# EAGLE design Main (EAGLE 7.1.0)
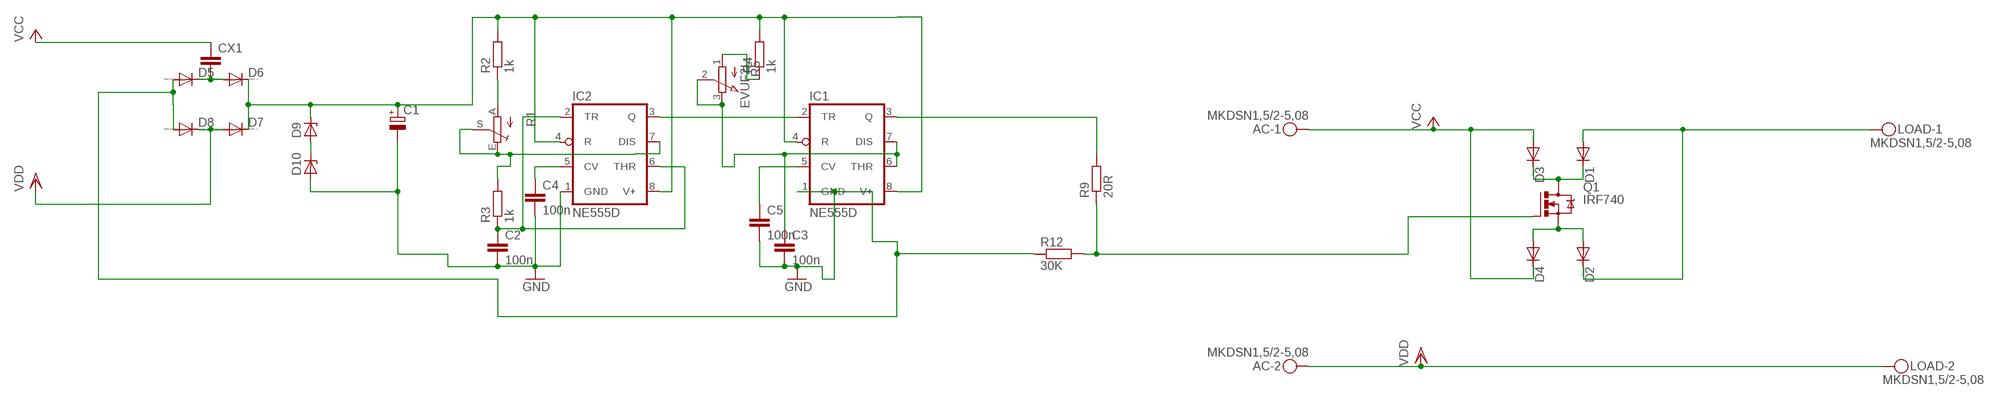
[diagram p0: schematic, sheet 1]

## Parts
AC  MKDSN1,5/2-5,08  [MKDSN1,5/2-5,08]
C1  CPOL-EUE2.5-7  [E2,5-7]
C2  100n  C-EUC0805  [C0805]
C3  100n  C-EUC0805  [C0805]
C4  100n  C-EUC0805  [C0805]
C5  100n  C-EUC0805  [C0805]
CX1  CXXC15B8  [XC15B8]
D1  DIODE-DO220S  [DO220S]
D2  DIODE-DO220S  [DO220S]
D3  DIODE-DO220S  [DO220S]
D4  DIODE-DO220S  [DO220S]
D5  DIODE-DO-214AC  [DO-214AC]
D6  DIODE-DO-214AC  [DO-214AC]
D7  DIODE-DO-214AC  [DO-214AC]
D8  DIODE-DO-214AC  [DO-214AC]
D9  ZENER-DIODESOD80C  [SOD80C]
D10  ZENER-DIODESOD80C  [SOD80C]
IC1  NE555D  [SO08]
IC2  NE555D  [SO08]
LOAD  MKDSN1,5/2-5,08  [MKDSN1,5/2-5,08]
Q1  IRF740  [TO220BV]
R1  TRIM_EU-S75H  [S75H]
R2  1k  R-EU_R1206  [R1206]
R3  1k  R-EU_R1206  [R1206]
R4  1k  R-EU_R1206  [R1206]
R5  EVUF2L  [EVUFXL]
R9  20R  R-EU_R1206  [R1206]
R12  30K  R-EU_R0805  [R0805]

## Nets
GND: C1.- C2.2 C3.2 C4.2 C5.2 D5.A D8.A D10.A IC1.1(GND) IC2.1(GND) R12.1
N$1: D2.A D4.A Q1.S
N$2: D1.C D3.C Q1.D
N$4: IC1.3(Q) R9.2
N$5: D1.A D2.C LOAD.1
N$9: CX1.2 D5.C D6.A
N$10: C1.+ D6.C D7.C D9.C IC1.4(R) IC1.8(V+) IC2.4(R) IC2.8(V+) R2.2 R4.2
N$11: D9.A D10.C
N$14: R1.A R2.1
N$15: IC2.7(DIS) R1.E R1.S R3.2
N$17: C2.1 IC2.2(TR) IC2.6(THR) R3.1
N$18: IC1.2(TR) IC2.3(Q)
N$20: C4.1 IC2.5(CV)
N$30: C5.1 IC1.5(CV)
N$31: Q1.G R9.1 R12.2
N$32: R4.1 R5.1(A)
N$33: C3.1 IC1.6(THR) IC1.7(DIS) R5.2(S) R5.3(E)
VCC: AC.1 CX1.1 D3.A D4.C
VDD: AC.2 D7.A D8.C LOAD.2

## Library data of the parts
AC LOAD = con-phoenix-508:MKDSN1,5/2-5,08: MKDSN 1,5/ 2-5,08 Printklemme Nennstrom: 13,5 A Nennspannung: 250 V Rastermaß: 5,08 mm Polzahl: 2 Anschlussart: Schraubanschluss Montage: Löten Anschlussrichtung Leiter/Platine: 0 ° Artikelnummer: 1729128 Source: http://eshop.phoenixcontact.com .. 1729128.pdf
C1 = rcl:CPOL-EU: POLARIZED CAPACITOR, European symbol
C2-C5 = rcl:C-EU: CAPACITOR, European symbol
CX1 = rcl:CX: X CAPACITOR for power line
D1-D8 = diode:DIODE-: DIODE
D9 D10 = diode:ZENER-DIODE: Z-Diode
IC1 IC2 = linear:*555: TIMER
Q1 = transistor-power:IRF740: N-CHANNEL MOS FET
R1 = pot:TRIM_EU-: POTENTIOMETER
R2-R4 R9 R12 = rcl:R-EU_: RESISTOR, European symbol
R5 = pot:EVU: 9 mm Square Rotary Potentiometers Source: Panasonic

## Board
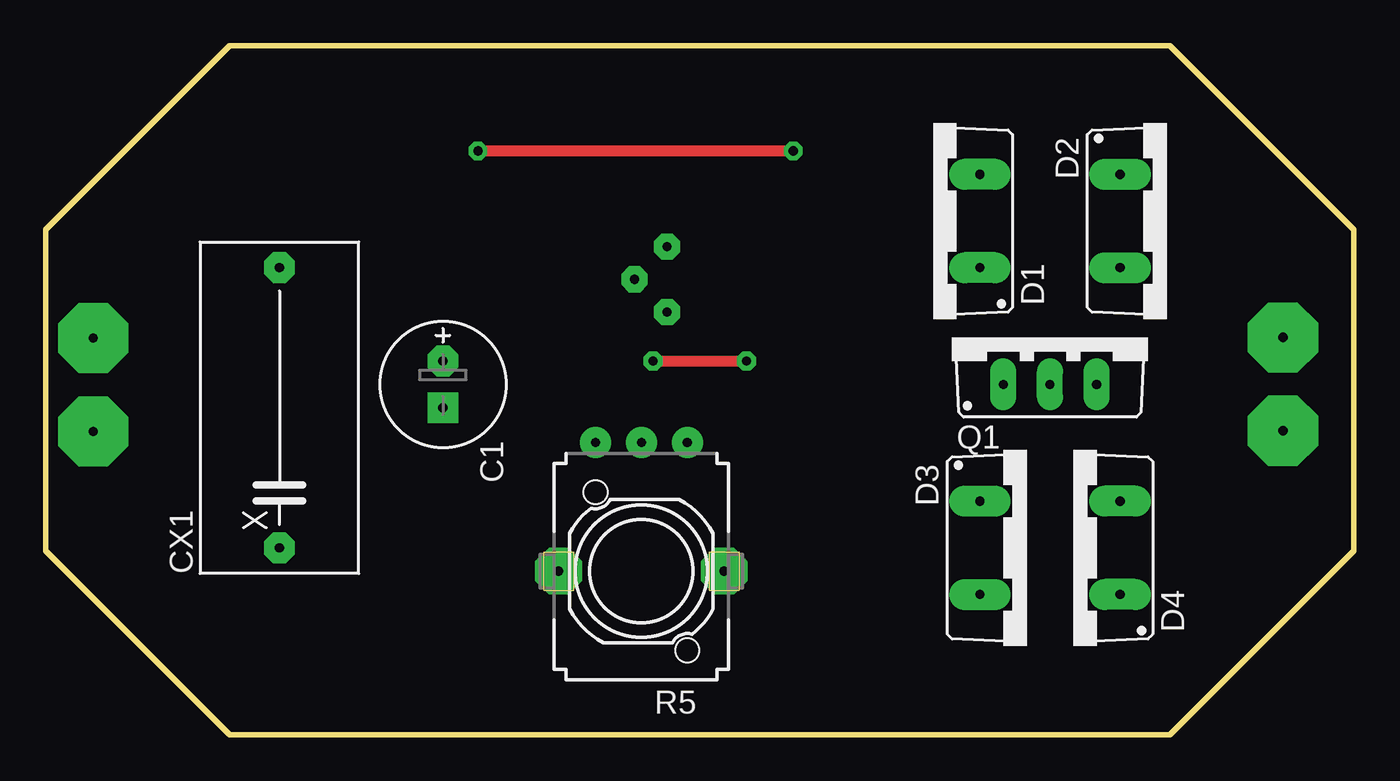
[diagram p1: board, top side]
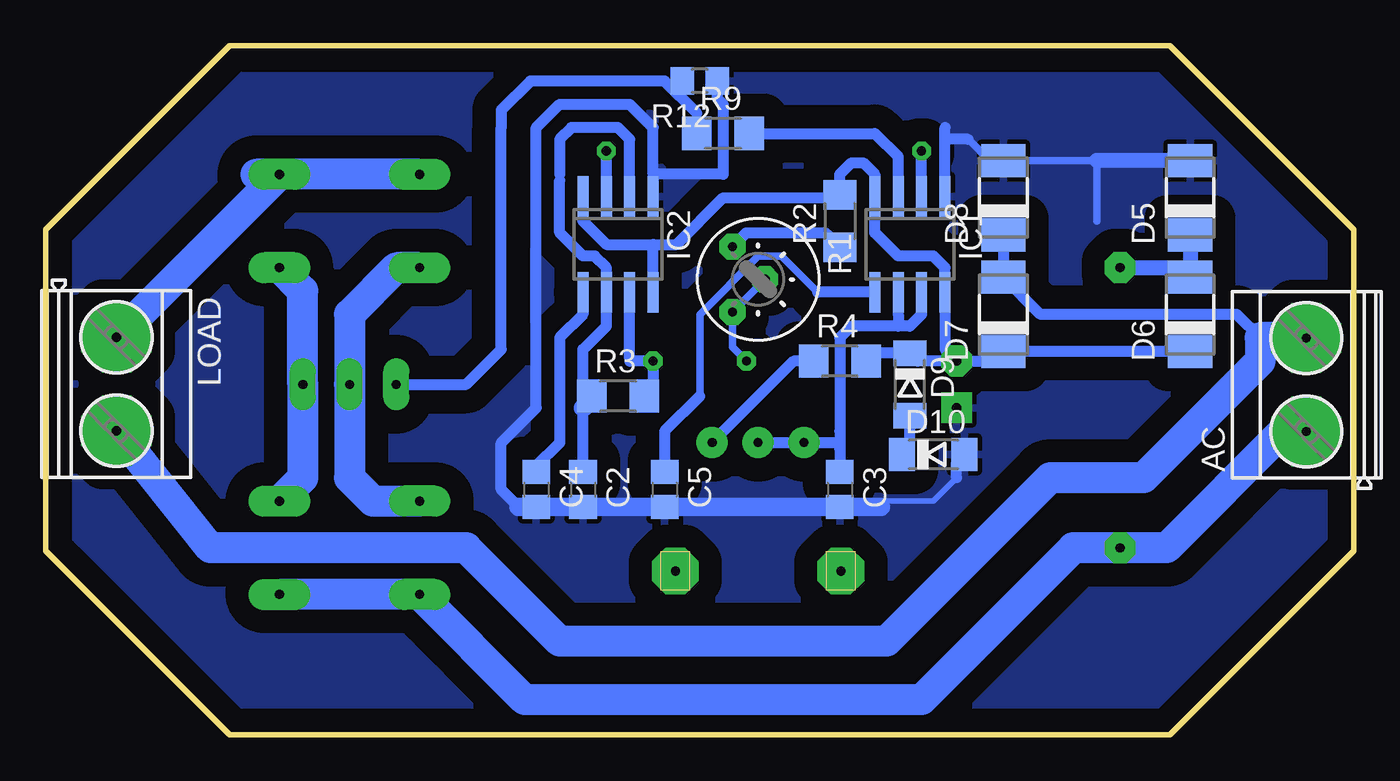
[diagram p2: board, bottom side, seen from below]

Size 71.12 x 37.47 mm. Coordinates in mm from the lower left corner, seen from the top.
Outline: 10,37.47 61.12,37.47 71.12,27.46 71.12,10 61.12,0 10,0 0,10 0,27.46 10,37.47
Copper layers (1*16): Top 0.035mm / dielectric 1.5mm / Bottom 0.035mm
Design rules "default": minimum track width 10mil, minimum drill 24mil, track to track 8mil, track to pad 8mil, pad to pad 8mil, via to via 8mil, smd to smd 8mil, copper to edge 40mil, drill to drill 8mil, minimum pad ring 10mil, minimum via ring 8mil, stop-mask expansion 4mil, vias tented up to drill 0mil, thermal gap 10mil

### Footprints (pad centres in the part's own frame; a part is rotated, then mirrored left to right if it is on the bottom)
MKDSN1,5/2-5,08 = drill 0.5 pad 3.81 octagon: 1 -2.561,0.025; 2 2.519,0.025
E2,5-7 = drill 0.5 pad 1.676 octagon: + -1.27,0 | drill 0.5 pad 1.676 square: - 1.27,0
C0805 = smd 1.3 x 1.5: 1 -0.95,0; 2 0.95,0
XC15B8 = drill 0.5 pad 1.676 octagon: 1 -7.62,0; 2 7.62,0
DO220S = drill 0.5 pad 1.676 long: A 2.54,-2.54; C -2.54,-2.54
DO-214AC = smd 1.8 x 2.4: A 2.025,0; C -2.025,0
SOD80C = smd 1.4 x 1.8: A 1.7,0; C -1.7,0
SO08 = smd 0.6 x 2.2: 1 -1.905,-2.6; 2 -0.635,-2.6; 3 0.635,-2.6; 4 1.905,-2.6; 5 1.905,2.6; 6 0.635,2.6; 7 -0.635,2.6; 8 -1.905,2.6
TO220BV = drill 0.5 pad 1.422 long: D 0,-2.54; G -2.54,-2.54; S 2.54,-2.54
S75H = drill 0.5 pad 1.422 octagon: A -1.778,-1.397; E 1.778,-1.397; S 0,0.381
R1206 = smd 1.6 x 1.803: 1 -1.422,0; 2 1.422,0
EVUFXL = drill 0.5 pad 1.676: 1 -2.5,-7; 2 0,-7; 3 2.5,-7 | drill 0.5 pad 2.54 octagon: M1 4.5,0; M2 -4.5,0
R0805 = smd 1.3 x 1.5: 1 -0.95,0; 2 0.95,0

### Placement (x,y rotation side)
AC  2.54,19.05 90 bottom
C1  21.59,19.05 270 top
C2  41.91,13.34 270 bottom
C3  27.94,13.34 270 bottom
C4  44.45,13.34 270 bottom
C5  37.47,13.34 270 bottom
CX1  12.7,17.78 90 top
D1  48.26,27.94 90 top
D2  60.96,27.94 270 top
D3  53.34,10.16 270 top
D4  55.88,10.16 90 top
D5  8.89,29.21 90 bottom
D6  8.89,22.86 90 bottom
D7  19.05,22.86 90 bottom
D8  19.05,29.21 90 bottom
D9  24.13,19.05 270 bottom
D10  22.86,15.24 0 bottom
IC1  24.13,26.67 180 bottom
IC2  40.01,26.67 180 bottom
LOAD  67.31,19.05 270 bottom
Q1  54.61,21.59 0 top
R1  32.39,24.77 270 bottom
R2  27.94,27.94 90 bottom
R3  40.01,18.41 0 bottom
R4  27.94,20.32 0 bottom
R5  32.39,8.89 180 top
R9  34.29,32.7 0 bottom
R12  35.56,35.56 180 bottom

### Tracks (layer width: path | path; a pad name or v marks a point on that pad's centre or on a via)
GND
  Bottom 0.305: 38.1,30.48 38.1,30.16 IC2.1 | R12.1 | 19.69,31.12 19.17,31.12 D8.A | 25.72,12.39 25.4,12.7 22.86,12.7 21.59,13.97
  Bottom 0.406: C5.2 C2.2 | 19.69,31.12 20.95,32.39 | D8.A 13.97,31.23 13.97,27.94
  Bottom 0.61: 20.95,32.39 22.23,32.39 | IC1.1 22.23,32.39 | 45.41,12.39 46.36,13.34 46.36,15.88 44.45,17.78 44.45,33.02 43.18,34.29 39.37,34.29 38.1,33.02 38.1,30.48 34.29,30.48 34.29,34.29 34.61,34.61 R12.1 | 22.23,32.39 22.23,33.02 | 21.59,13.97 21.59,14.81 D10.A
  Bottom 0.813: D5.A 13.97,31.23
  Bottom 1.016: C2.2 C4.2 | 45.41,12.39 C5.2 C3.2 25.72,12.39
  pour Bottom (isolate 1.27): 0,27.94 0,28.1 10,38.1 60.96,38.1 60.96,37.94 70.96,27.94 71.12,27.94 71.12,10 61.12,0 60.96,0 10.16,0 10.16,0.16 0.16,10.16 0,10.16
N$1
  Bottom 1.676: D4.A 57.15,13.97 Q1.S 57.15,24.13 D2.A
N$2
  Bottom 0.406: D3.C 52.07,12.7
  Bottom 1.676: D3.C 53.34,12.7 54.61,13.97 Q1.D 54.61,22.86 52.07,25.4 D1.C
N$4
  Bottom 0.61: IC1.3 24.77,31.43 26.04,32.7 R9.2
N$5
  Bottom 1.676: D1.A D2.C | D2.C 59.69,30.48 D2.C | D2.C 67.31,21.59 66.67,21.59 LOAD.1
N$9
  Bottom 0.406: 8.89,25.4 9.41,25.4 D6.A 8.89,25.4
  Bottom 0.813: CX1.2 8.89,25.4 D5.C
N$10
  Bottom 0.406: 23.7,20.32 D9.C | 26.09,20.75 R4.2
  Bottom 0.61: C1.+ 19.05,20.32 D7.C D6.C | C1.+ 23.7,20.32 | C1.+ 22.23,20.95 IC1.8 22.23,25.4 22.86,26.04 24.77,26.04 26.04,27.3 IC1.4 26.04,30.48 26.67,31.12 27.31,31.12 27.94,30.48 R2.2 28.09,29.21 34.29,29.21 36.83,26.67 38.1,26.67 | D9.C 26.09,20.75 | IC2.8 38.1,26.67 | IC2.4 41.91,27.94 40.64,26.67 38.1,26.67
N$11
  Bottom 0.406: D10.C 24.13,15.24 D10.C
  Bottom 0.61: 24.13,15.24 D9.A
N$14
  Bottom 0.406: 28.73,27.3 28.6,27.18
  Bottom 0.61: 28.6,27.18 R2.1 | R1.A 33.02,27.3 28.73,27.3
N$15  (via drill 0.5 pad 1.02)
  Top 0.61: v33.02,20.32 v38.1,20.32
  Bottom 0.406: 39.37,20.47 39.45,20.4 39.37,20.32 | R1.S R1.E 33.78,21.08 v33.02,20.32
  Bottom 0.61: 39.37,20.32 v38.1,20.32 38.1,18.9 R3.2 | 39.37,20.47 IC2.7
N$17
  Bottom 0.406: 43.18,30.16 43.18,30.48
  Bottom 0.61: 43.18,30.16 43.18,27.3 41.91,26.04 41.28,26.04 40.64,25.4 IC2.6 40.64,22.23 41.91,20.95 41.91,17.78 C2.1 | IC2.2 39.37,32.39 40.01,33.02 42.55,33.02 43.18,32.39 43.18,30.48
  Bottom 1.016: R3.1 41.43,18.26 41.91,17.78
N$18  (via drill 0.5 pad 1.02)
  Top 0.61: v40.64,31.75 v23.5,31.75
  Bottom 0.406: 23.5,31.43 v23.5,31.75 | v23.5,31.75 23.5,31.43 | v23.5,31.75 23.18,31.75 23.5,31.43
  Bottom 0.61: IC1.2 23.5,31.43 | IC2.3 v40.64,31.75
N$20
  Bottom 0.406: C4.1 44.45,14.61
  Bottom 0.61: IC2.5 41.91,22.86 43.18,21.59 43.18,15.88 44.45,14.61
N$30
  Bottom 0.406: 29.15,24.07 31.12,26.04 32.39,26.04 35.56,22.86 35.56,18.41
  Bottom 0.61: IC1.5 29.15,24.07 | 35.56,18.41 37.47,16.51 C5.1
N$31
  Bottom 0.305: 35.71,33.49 35.71,33.81 | R12.2 37.15,35.25 37.47,35.56
  Bottom 0.61: Q1.G 48.26,19.05 46.36,20.95 46.36,33.02 46.36,33.97 44.77,35.56 37.47,35.56 35.71,33.81 | R9.1 35.71,33.49
N$32
  Bottom 0.61: R4.1 30.46,20.32 R5.1
N$33
  Bottom 0.406: 27.96,15.89 27.94,15.88
  Bottom 0.61: IC1.7 23.5,22.86 24.13,22.23 24.77,22.23 | IC1.6 24.77,22.86 24.77,22.23 | 24.77,22.23 27.31,22.23 27.94,21.59 27.94,16.51 27.94,15.88 27.94,15.55 C3.1 | R5.2 R5.3 27.96,15.89
VCC
  Bottom 0.406: 2.54,16.51 AC.1
  Bottom 1.676: 2.54,16.51 3.81,16.51 10.16,10.16 CX1.1 15.24,10.16 23.5,1.91 45.09,1.91 D3.A D4.C
VDD
  Bottom 0.406: D7.A 19.81,24.88 | 5.08,21.59 2.59,21.59 AC.2
  Bottom 0.61: D8.C D7.A 17.03,22.86 11.43,22.86 6.35,22.86 5.08,21.59
  Bottom 1.676: 5.08,21.59 2.54,21.59 5.08,21.59 | 5.08,21.59 5.08,20.32 11.43,13.97 16.51,13.97 25.4,5.08 43.18,5.08 48.26,10.16 62.18,10.16 LOAD.2